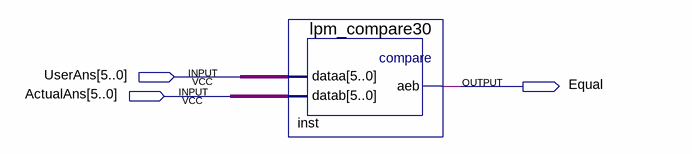
[diagram p0: schematic sheet]
// Quartus schematic Compare.bdf as structural Verilog: 1 symbols, 3 pins
module Compare (
  input  [5:0] UserAns,
  input  [5:0] ActualAns,
  output Equal
);

  lpm_compare30 inst (.dataa(UserAns), .datab(ActualAns), .aeb(Equal));
endmodule
